# EAGLE schematic FedorBall (EAGLE 6.2)
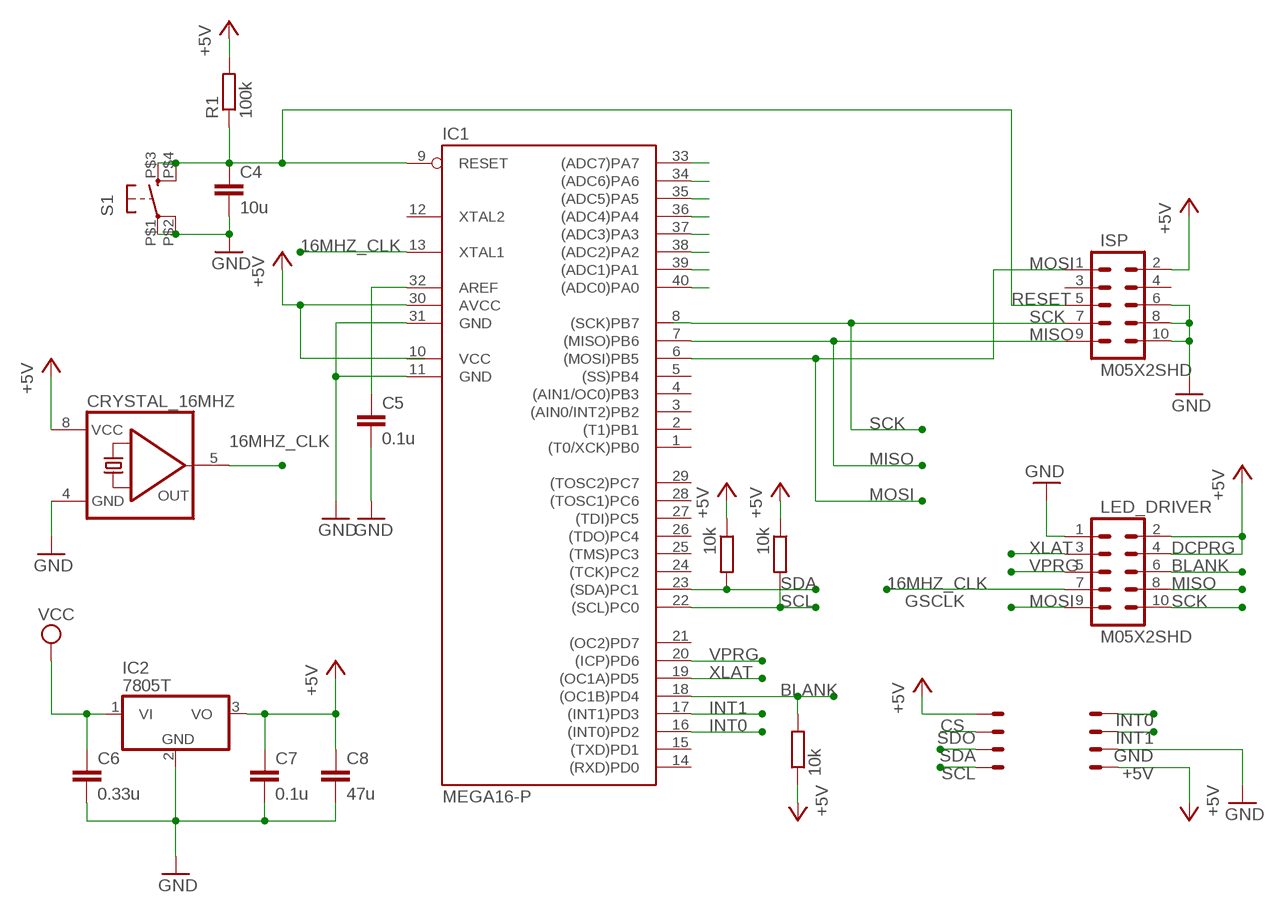
[diagram p0: schematic, sheet 1]

## Parts
C4  10u  C-EU050-024X044  [C050-024X044]
C5  0.1u  C-EU050-024X044  [C050-024X044]
C6  0.33u  C-EU050-024X044  [C050-024X044]
C7  0.1u  C-EU050-024X044  [C050-024X044]
C8  47u  C-EU050-024X044  [C050-024X044]
CRYSTAL_16MHZ  QG5460  [DIL08S]
IC1  MEGA16-P  [DIL40]
IC2  7805T  [TO220H]
ISP  M05X2SHD  [2X5-SHROUDED]
LED_DRIVER  M05X2SHD  [2X5-SHROUDED]
R1  100k  R-EU_0207/10  [0207/10]
R2  10k  R-EU_0207/10  [0207/10]
R5  10k  R-EU_0207/10  [0207/10]
R6  10k  R-EU_0207/10  [0207/10]
S1  TAC_SWITCHKSA_SEALED  [KSA_SEALED_TAC_SWITCH]
X1  22-23-2041  [22-23-2041]
X2  22-23-2041  [22-23-2041]

## Nets
16MHZ_CLK: CRYSTAL_16MHZ.5(OUT) IC1.13(XTAL1) LED_DRIVER.7
+5V: C7.1 C8.1 CRYSTAL_16MHZ.8(VCC) IC1.10(VCC) IC1.30(AVCC) IC2.3(VO) ISP.2 LED_DRIVER.2 LED_DRIVER.4 R1.2 R2.1 R5.1 R6.1 X1.1 X2.4
BLANK: IC1.18((OC1B)PD4) LED_DRIVER.6 R2.2
GND: C4.2 C5.2 C6.2 C7.2 C8.2 CRYSTAL_16MHZ.4(GND) IC1.11(GND) IC1.31(GND) IC2.2(GND) ISP.6 ISP.8 ISP.10 LED_DRIVER.1 S1.P$1 S1.P$2 X1.2
INT0: IC1.16((INT0)PD2) X1.4
INT1: IC1.17((INT1)PD3) X1.3
MISO: IC1.7((MISO)PB6) ISP.9 LED_DRIVER.8
MOSI: IC1.6((MOSI)PB5) ISP.1 LED_DRIVER.9
N$2: C5.1 IC1.32(AREF)
N$6: C4.1 IC1.9(RESET) ISP.5 R1.1 S1.P$3 S1.P$4
N$9: IC1.33((ADC7)PA7)
N$10: IC1.34((ADC6)PA6)
N$11: IC1.35((ADC5)PA5)
N$12: IC1.36((ADC4)PA4)
N$13: IC1.37((ADC3)PA3)
N$14: IC1.38((ADC2)PA2)
N$15: IC1.39((ADC1)PA1)
N$16: IC1.40((ADC0)PA0)
SCK: IC1.8((SCK)PB7) ISP.7 LED_DRIVER.10
SCL: IC1.22((SCL)PC0) R6.2 X2.1
SDA: IC1.23((SDA)PC1) R5.2 X2.2
SDO: X2.3
VCC: C6.1 IC2.1(VI)
VPRG: IC1.20((ICP)PD6) LED_DRIVER.5
XLAT: IC1.19((OC1A)PD5) LED_DRIVER.3
Unconnected: IC1.1((T0/XCK)PB0) IC1.2((T1)PB1) IC1.3((AIN0/INT2)PB2) IC1.4((AIN1/OC0)PB3) IC1.5((SS)PB4) IC1.12(XTAL2) IC1.14((RXD)PD0) IC1.15((TXD)PD1) IC1.21((OC2)PD7) IC1.24((TCK)PC2) IC1.25((TMS)PC3) IC1.26((TDO)PC4) IC1.27((TDI)PC5) IC1.28((TOSC1)PC6) IC1.29((TOSC2)PC7) ISP.3 ISP.4

## Notes on the sheet
- MOSI
- RESET
- SCK
- MISO
- DCPRG
- GSCLK
- CS

## Library data of the parts
C4-C8 = rcl:C-EU: CAPACITOR, European symbol
CRYSTAL_16MHZ = crystal:QG5460: CRYSTAL RESONATOR; OC_FARNELL: unknown; OC_NEWARK: unknown
IC1 = atmel:MEGA16-P: MICROCONTROLLER 16 Kbytes FLASH 1 kbytes SRAM 512 bytes EEPROM USART 8-channel 10 bit ADC Source: avr.lbr; MPN: ATMEGA16-16PU; OC_FARNELL: 9171142; OC_NEWARK: 01M6885
IC2 = linear:78*: Positive VOLTAGE REGULATOR Source: http://cache.national.com/ds/LM/LM78L05.pdf http://www.fairchildsemi.com/ds/LM/LM7805.pdf
ISP LED_DRIVER = SparkFun:M05X2: Header 5x2 Standard 10-pin dual row 0.1" header. Commonly used with AVR-ISP. Use with Spark Fun Electronics SKU: PRT-00778
R1 R2 R5 R6 = rcl:R-EU_: RESISTOR, European symbol
S1 = SparkFun:TAC_SWITCH: Momentary Switch Button commonly used for reset or general input. Spark Fun Electronics SKU : COM-00097
X1 X2 = con-molex:22-23-2041: .100" (2.54mm) Center Header - 4 Pin; MF: MOLEX; MPN: 22-23-2041; OC_FARNELL: 1462920; OC_NEWARK: 38C0355